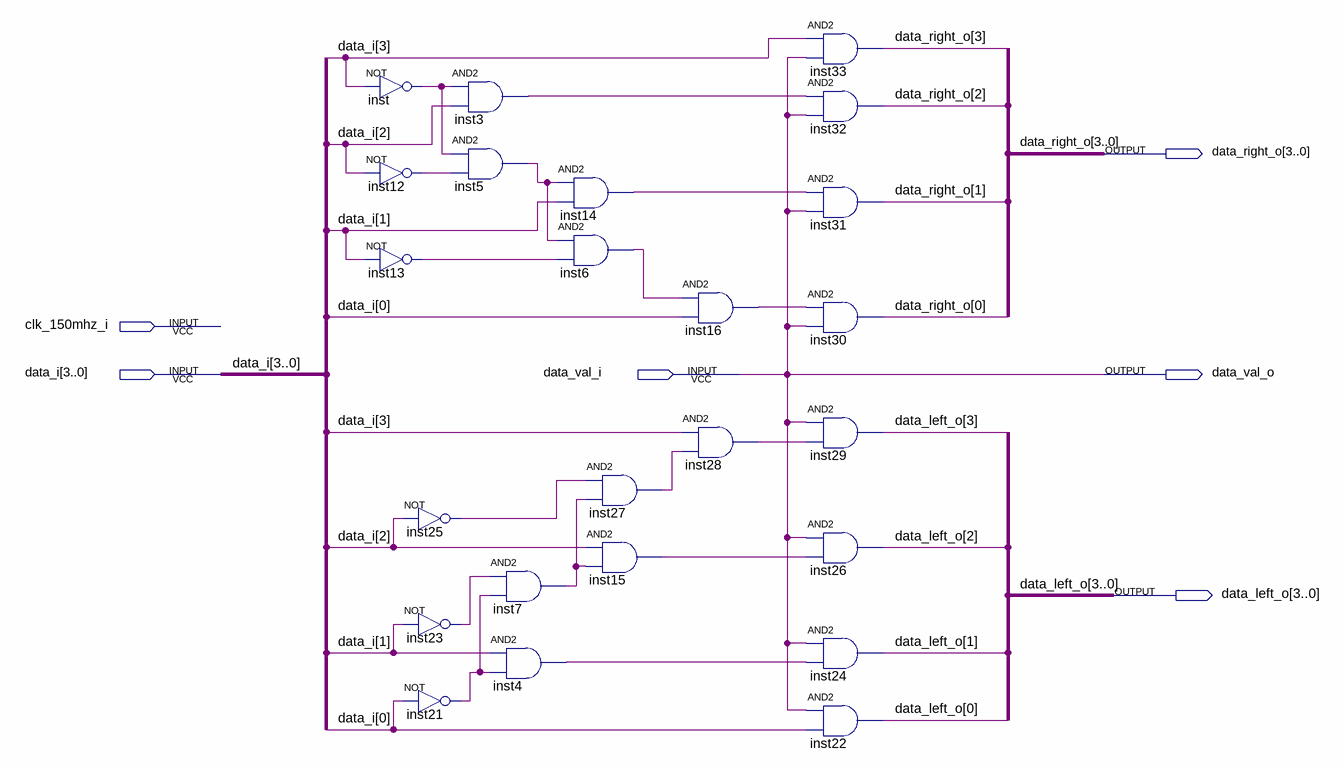
[diagram p0: schematic sheet]
// Quartus schematic priority_encoder_4.bdf as structural Verilog: 24 symbols, 6 pins
module priority_encoder_4 (
  input  clk_150mhz_i,
  input  [3:0] data_i,
  input  data_val_i,
  output [3:0] data_right_o,
  output data_val_o,
  output [3:0] data_left_o
);

  wire inst3_out, inst4_out, inst5_out, inst6_out, inst7_out, inst12_out, inst13_out, inst14_out, inst15_out,
       inst16_out, inst21_out, inst23_out, inst25_out, inst27_out, inst28_out, inst_out;

  not inst (inst_out, data_i[3]);
  not inst12 (inst12_out, data_i[2]);
  not inst13 (inst13_out, data_i[1]);
  not inst25 (inst25_out, data_i[2]);
  not inst23 (inst23_out, data_i[1]);
  not inst21 (inst21_out, data_i[0]);
  and inst3 (inst3_out, inst_out, data_i[2]);
  and inst5 (inst5_out, inst_out, inst12_out);
  and inst7 (inst7_out, inst23_out, inst21_out);
  and inst4 (inst4_out, data_i[1], inst21_out);
  and inst14 (inst14_out, inst5_out, data_i[1]);
  and inst6 (inst6_out, inst5_out, inst13_out);
  and inst27 (inst27_out, inst25_out, inst7_out);
  and inst15 (inst15_out, data_i[2], inst7_out);
  and inst16 (inst16_out, inst6_out, data_i[0]);
  and inst28 (inst28_out, data_i[3], inst27_out);
  and inst33 (data_right_o[3], data_i[3], data_val_i);
  and inst32 (data_right_o[2], inst3_out, data_val_i);
  and inst31 (data_right_o[1], inst14_out, data_val_i);
  and inst30 (data_right_o[0], inst16_out, data_val_i);
  and inst29 (data_left_o[3], data_val_i, inst28_out);
  and inst26 (data_left_o[2], data_val_i, inst15_out);
  and inst24 (data_left_o[1], data_val_i, inst4_out);
  and inst22 (data_left_o[0], data_val_i, data_i[0]);

  assign data_val_o = data_val_i;
endmodule
